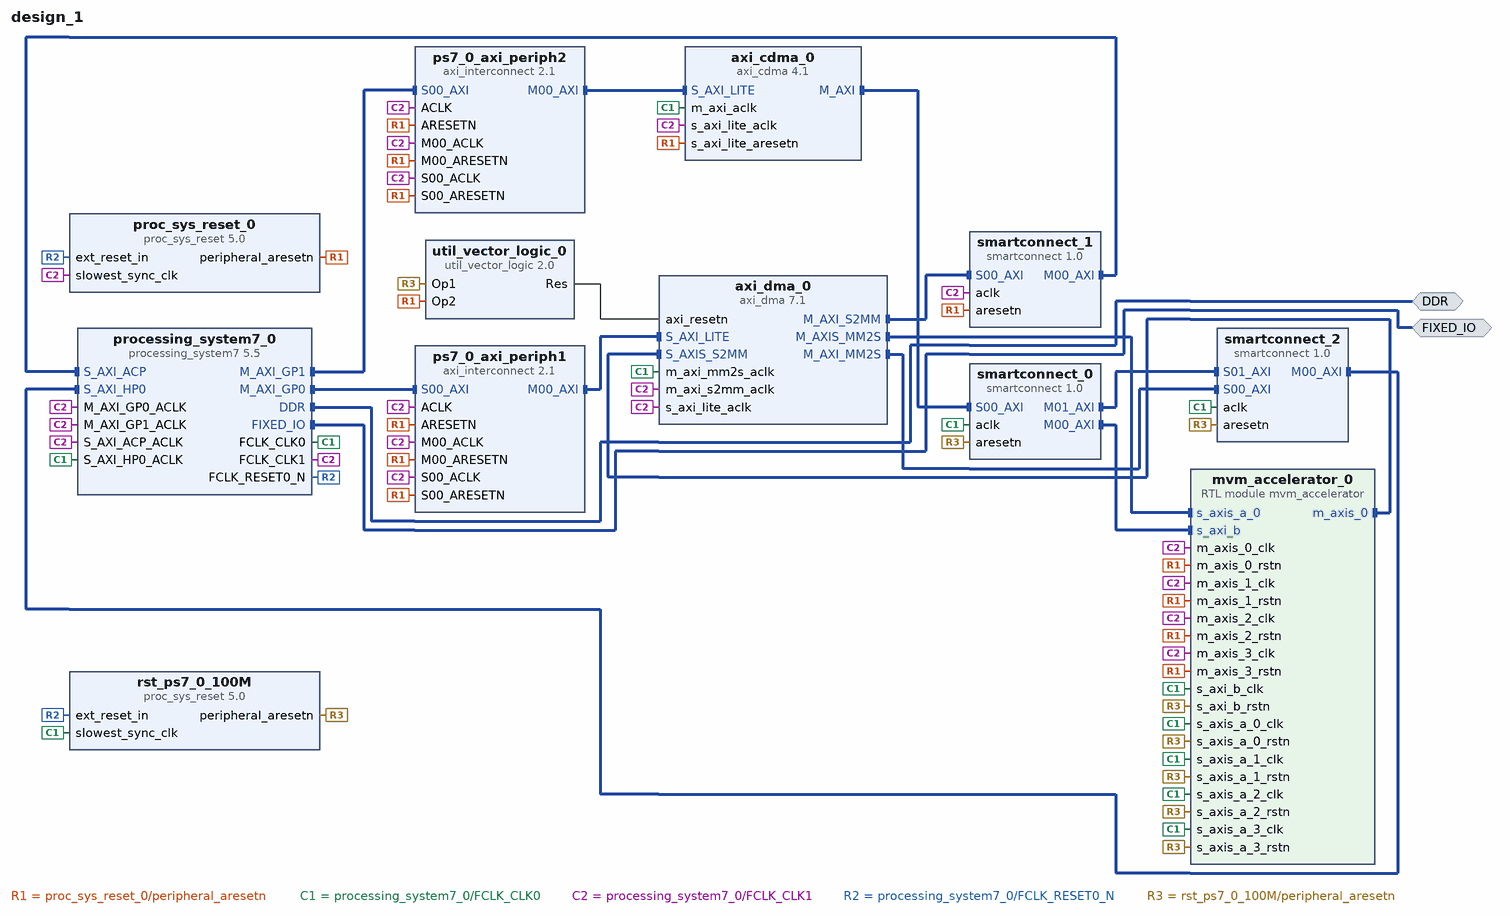
[diagram p0: block diagram of the top level]
# Vivado block design design_1, xc7z020clg400-1, Vivado 2023.2
create_bd_design design_1

create_bd_intf_port -mode Master -vlnv xilinx.com:interface:ddrx_rtl:1.0 DDR
create_bd_intf_port -mode Master -vlnv xilinx.com:display_processing_system7:fixedio_rtl:1.0 FIXED_IO

create_bd_cell -type ip -vlnv xilinx.com:ip:axi_dma:7.1 axi_dma_0
set_property -dict [list \
  CONFIG.c_include_mm2s_dre 1 \
  CONFIG.c_include_s2mm 1 \
  CONFIG.c_include_s2mm_dre 1 \
  CONFIG.c_include_sg 0 \
  CONFIG.c_m_axi_mm2s_data_width 64 \
  CONFIG.c_m_axi_s2mm_data_width 64 \
  CONFIG.c_m_axis_mm2s_tdata_width 64 \
  CONFIG.c_mm2s_burst_size 256 \
  CONFIG.c_s2mm_burst_size 8 \
  CONFIG.c_s_axis_s2mm_tdata_width 64 \
  CONFIG.c_sg_length_width 18 \
] [get_bd_cells axi_dma_0]
create_bd_cell -type ip -vlnv xilinx.com:ip:proc_sys_reset:5.0 rst_ps7_0_100M
create_bd_cell -type module -reference mvm_accelerator mvm_accelerator_0
set_property -dict [list \
  CONFIG.AXI_RAM_ID_WIDTH 8 \
  CONFIG.DATA_WIDTH 64 \
  CONFIG.ELEMENTS_PER_ROW 8192 \
  CONFIG.ELEMENTS_PER_WORD 1 \
  CONFIG.NUM_CHANNELS 1 \
  CONFIG.NUM_RAM_PARTITIONS 1 \
  CONFIG.NUM_ROWS 1024 \
  CONFIG.ROWS_PER_CHANNEL 1024 \
  CONFIG.STRB_WIDTH 8 \
  CONFIG.WORDS_PER_ROW 8192 \
] [get_bd_cells mvm_accelerator_0]
create_bd_cell -type ip -vlnv xilinx.com:ip:axi_interconnect:2.1 ps7_0_axi_periph1
set_property -dict {CONFIG.ENABLE_ADVANCED_OPTIONS 0 CONFIG.NUM_MI 1 CONFIG.NUM_SI 1} [get_bd_cells ps7_0_axi_periph1]
create_bd_cell -type ip -vlnv xilinx.com:ip:processing_system7:5.5 processing_system7_0
set_property -dict [list \
  CONFIG.PCW_APU_PERIPHERAL_FREQMHZ 650 \
  CONFIG.PCW_CRYSTAL_PERIPHERAL_FREQMHZ 50 \
  CONFIG.PCW_ENET0_ENET0_IO {MIO 16 .. 27} \
  CONFIG.PCW_ENET0_GRP_MDIO_ENABLE 1 \
  CONFIG.PCW_ENET0_GRP_MDIO_IO {MIO 52 .. 53} \
  CONFIG.PCW_ENET0_PERIPHERAL_ENABLE 1 \
  CONFIG.PCW_ENET0_RESET_ENABLE 1 \
  CONFIG.PCW_ENET0_RESET_IO {MIO 9} \
  CONFIG.PCW_ENET_RESET_ENABLE 1 \
  CONFIG.PCW_ENET_RESET_SELECT {Share reset pin} \
  CONFIG.PCW_EN_CLK1_PORT 1 \
  CONFIG.PCW_FCLK_CLK1_BUF TRUE \
  CONFIG.PCW_FPGA0_PERIPHERAL_FREQMHZ 200 \
  CONFIG.PCW_FPGA1_PERIPHERAL_FREQMHZ 100 \
  CONFIG.PCW_FPGA_FCLK1_ENABLE 1 \
  CONFIG.PCW_GPIO_MIO_GPIO_ENABLE 1 \
  CONFIG.PCW_GPIO_MIO_GPIO_IO MIO \
  CONFIG.PCW_I2C_RESET_ENABLE 1 \
  CONFIG.PCW_M_AXI_GP0_FREQMHZ 10 \
  CONFIG.PCW_PERIPHERAL_BOARD_PRESET part0 \
  CONFIG.PCW_PRESET_BANK1_VOLTAGE {LVCMOS 1.8V} \
  CONFIG.PCW_QSPI_PERIPHERAL_ENABLE 0 \
  CONFIG.PCW_SD0_GRP_CD_ENABLE 1 \
  CONFIG.PCW_SD0_GRP_CD_IO {MIO 47} \
  CONFIG.PCW_SD0_GRP_WP_ENABLE 0 \
  CONFIG.PCW_SD0_PERIPHERAL_ENABLE 1 \
  CONFIG.PCW_SD0_SD0_IO {MIO 40 .. 45} \
  CONFIG.PCW_SDIO_PERIPHERAL_FREQMHZ 50 \
  CONFIG.PCW_S_AXI_HP0_FREQMHZ 10 \
  CONFIG.PCW_UART0_PERIPHERAL_ENABLE 1 \
  CONFIG.PCW_UART0_UART0_IO {MIO 14 .. 15} \
  CONFIG.PCW_UART1_PERIPHERAL_ENABLE 0 \
  CONFIG.PCW_UART_PERIPHERAL_FREQMHZ 100 \
  CONFIG.PCW_UIPARAM_DDR_BUS_WIDTH {16 Bit} \
  CONFIG.PCW_UIPARAM_DDR_FREQ_MHZ 525 \
  CONFIG.PCW_UIPARAM_DDR_PARTNO {MT41J256M16 RE-125} \
  CONFIG.PCW_USB0_PERIPHERAL_ENABLE 0 \
  CONFIG.PCW_USB_RESET_ENABLE 1 \
  CONFIG.PCW_USE_DEFAULT_ACP_USER_VAL 1 \
  CONFIG.PCW_USE_M_AXI_GP1 1 \
  CONFIG.PCW_USE_S_AXI_ACP 1 \
  CONFIG.PCW_USE_S_AXI_HP0 1 \
] [get_bd_cells processing_system7_0]
# 502 more settings of processing_system7_0 are not shown: defaults, MIO pin electricals, DDR timing, and values the tool derives
create_bd_cell -type ip -vlnv xilinx.com:ip:proc_sys_reset:5.0 proc_sys_reset_0
create_bd_cell -type ip -vlnv xilinx.com:ip:util_vector_logic:2.0 util_vector_logic_0
set_property -dict {CONFIG.C_SIZE 1} [get_bd_cells util_vector_logic_0]
create_bd_cell -type ip -vlnv xilinx.com:ip:axi_cdma:4.1 axi_cdma_0
set_property -dict [list \
  CONFIG.C_INCLUDE_DRE 1 \
  CONFIG.C_INCLUDE_SF 0 \
  CONFIG.C_INCLUDE_SG 0 \
  CONFIG.C_M_AXI_DATA_WIDTH 64 \
  CONFIG.C_M_AXI_MAX_BURST_LEN 256 \
  CONFIG.C_USE_DATAMOVER_LITE 0 \
] [get_bd_cells axi_cdma_0]
create_bd_cell -type ip -vlnv xilinx.com:ip:axi_interconnect:2.1 ps7_0_axi_periph2
set_property -dict {CONFIG.ENABLE_ADVANCED_OPTIONS 0 CONFIG.NUM_MI 1 CONFIG.NUM_SI 1} [get_bd_cells ps7_0_axi_periph2]
create_bd_cell -type ip -vlnv xilinx.com:ip:smartconnect:1.0 smartconnect_0
set_property -dict {CONFIG.NUM_MI 2 CONFIG.NUM_SI 1} [get_bd_cells smartconnect_0]
create_bd_cell -type ip -vlnv xilinx.com:ip:smartconnect:1.0 smartconnect_1
set_property -dict {CONFIG.NUM_SI 1} [get_bd_cells smartconnect_1]
create_bd_cell -type ip -vlnv xilinx.com:ip:smartconnect:1.0 smartconnect_2
set_property -dict {CONFIG.NUM_SI 2} [get_bd_cells smartconnect_2]

# ---- connections ----

connect_bd_intf_net [get_bd_intf_pins axi_cdma_0/M_AXI] [get_bd_intf_pins smartconnect_0/S00_AXI]
connect_bd_intf_net [get_bd_intf_pins axi_dma_0/M_AXIS_MM2S] [get_bd_intf_pins mvm_accelerator_0/s_axis_a_0]
connect_bd_intf_net [get_bd_intf_pins smartconnect_2/S00_AXI] [get_bd_intf_pins axi_dma_0/M_AXI_MM2S]
connect_bd_intf_net [get_bd_intf_pins axi_dma_0/M_AXI_S2MM] [get_bd_intf_pins smartconnect_1/S00_AXI]
connect_bd_intf_net [get_bd_intf_pins mvm_accelerator_0/m_axis_0] [get_bd_intf_pins axi_dma_0/S_AXIS_S2MM]
connect_bd_intf_net [get_bd_intf_ports DDR] [get_bd_intf_pins processing_system7_0/DDR]
connect_bd_intf_net [get_bd_intf_ports FIXED_IO] [get_bd_intf_pins processing_system7_0/FIXED_IO]
connect_bd_intf_net [get_bd_intf_pins ps7_0_axi_periph1/S00_AXI] [get_bd_intf_pins processing_system7_0/M_AXI_GP0]
connect_bd_intf_net [get_bd_intf_pins processing_system7_0/M_AXI_GP1] [get_bd_intf_pins ps7_0_axi_periph2/S00_AXI]
connect_bd_intf_net [get_bd_intf_pins ps7_0_axi_periph1/M00_AXI] [get_bd_intf_pins axi_dma_0/S_AXI_LITE]
connect_bd_intf_net [get_bd_intf_pins ps7_0_axi_periph2/M00_AXI] [get_bd_intf_pins axi_cdma_0/S_AXI_LITE]
connect_bd_intf_net [get_bd_intf_pins smartconnect_0/M00_AXI] [get_bd_intf_pins mvm_accelerator_0/s_axi_b]
connect_bd_intf_net [get_bd_intf_pins smartconnect_0/M01_AXI] [get_bd_intf_pins smartconnect_2/S01_AXI]
connect_bd_intf_net [get_bd_intf_pins smartconnect_1/M00_AXI] [get_bd_intf_pins processing_system7_0/S_AXI_ACP]
connect_bd_intf_net [get_bd_intf_pins smartconnect_2/M00_AXI] [get_bd_intf_pins processing_system7_0/S_AXI_HP0]
connect_bd_net -net ARESETN_1 [get_bd_pins proc_sys_reset_0/peripheral_aresetn] \
  [get_bd_pins ps7_0_axi_periph1/ARESETN] [get_bd_pins ps7_0_axi_periph1/S00_ARESETN] \
  [get_bd_pins ps7_0_axi_periph1/M00_ARESETN] [get_bd_pins util_vector_logic_0/Op2] [get_bd_pins ps7_0_axi_periph2/ARESETN] \
  [get_bd_pins ps7_0_axi_periph2/S00_ARESETN] [get_bd_pins ps7_0_axi_periph2/M00_ARESETN] \
  [get_bd_pins axi_cdma_0/s_axi_lite_aresetn] [get_bd_pins smartconnect_1/aresetn] \
  [get_bd_pins mvm_accelerator_0/m_axis_0_rstn] [get_bd_pins mvm_accelerator_0/m_axis_1_rstn] \
  [get_bd_pins mvm_accelerator_0/m_axis_2_rstn] [get_bd_pins mvm_accelerator_0/m_axis_3_rstn]
connect_bd_net [get_bd_pins processing_system7_0/FCLK_CLK0] \
  [get_bd_pins axi_dma_0/m_axi_mm2s_aclk] [get_bd_pins processing_system7_0/S_AXI_HP0_ACLK] \
  [get_bd_pins rst_ps7_0_100M/slowest_sync_clk] [get_bd_pins axi_cdma_0/m_axi_aclk] [get_bd_pins smartconnect_0/aclk] \
  [get_bd_pins smartconnect_2/aclk] [get_bd_pins mvm_accelerator_0/s_axis_a_0_clk] \
  [get_bd_pins mvm_accelerator_0/s_axi_b_clk] [get_bd_pins mvm_accelerator_0/s_axis_a_1_clk] \
  [get_bd_pins mvm_accelerator_0/s_axis_a_2_clk] [get_bd_pins mvm_accelerator_0/s_axis_a_3_clk]
connect_bd_net [get_bd_pins processing_system7_0/FCLK_CLK1] \
  [get_bd_pins processing_system7_0/S_AXI_ACP_ACLK] [get_bd_pins axi_dma_0/m_axi_s2mm_aclk] \
  [get_bd_pins ps7_0_axi_periph1/S00_ACLK] [get_bd_pins ps7_0_axi_periph1/M00_ACLK] [get_bd_pins axi_dma_0/s_axi_lite_aclk] \
  [get_bd_pins proc_sys_reset_0/slowest_sync_clk] [get_bd_pins ps7_0_axi_periph1/ACLK] \
  [get_bd_pins processing_system7_0/M_AXI_GP0_ACLK] [get_bd_pins processing_system7_0/M_AXI_GP1_ACLK] \
  [get_bd_pins axi_cdma_0/s_axi_lite_aclk] [get_bd_pins ps7_0_axi_periph2/ACLK] [get_bd_pins ps7_0_axi_periph2/S00_ACLK] \
  [get_bd_pins ps7_0_axi_periph2/M00_ACLK] [get_bd_pins smartconnect_1/aclk] [get_bd_pins mvm_accelerator_0/m_axis_0_clk] \
  [get_bd_pins mvm_accelerator_0/m_axis_1_clk] [get_bd_pins mvm_accelerator_0/m_axis_2_clk] \
  [get_bd_pins mvm_accelerator_0/m_axis_3_clk]
connect_bd_net [get_bd_pins processing_system7_0/FCLK_RESET0_N] [get_bd_pins rst_ps7_0_100M/ext_reset_in] [get_bd_pins proc_sys_reset_0/ext_reset_in]
connect_bd_net [get_bd_pins rst_ps7_0_100M/peripheral_aresetn] \
  [get_bd_pins util_vector_logic_0/Op1] [get_bd_pins smartconnect_0/aresetn] [get_bd_pins smartconnect_2/aresetn] \
  [get_bd_pins mvm_accelerator_0/s_axis_a_0_rstn] [get_bd_pins mvm_accelerator_0/s_axi_b_rstn] \
  [get_bd_pins mvm_accelerator_0/s_axis_a_1_rstn] [get_bd_pins mvm_accelerator_0/s_axis_a_2_rstn] \
  [get_bd_pins mvm_accelerator_0/s_axis_a_3_rstn]
connect_bd_net [get_bd_pins util_vector_logic_0/Res] [get_bd_pins axi_dma_0/axi_resetn]

# ---- address map ----
assign_bd_address -offset 0x00000000 -range 512M -target_address_space [get_bd_addr_spaces axi_cdma_0/Data] [get_bd_addr_segs processing_system7_0/S_AXI_HP0/HP0_DDR_LOWOCM]
assign_bd_address -offset 0x80000000 -range 256K -target_address_space [get_bd_addr_spaces axi_cdma_0/Data] [get_bd_addr_segs mvm_accelerator_0/s_axi_b/reg0]
assign_bd_address -offset 0x00000000 -range 512M -target_address_space [get_bd_addr_spaces axi_dma_0/Data_MM2S] [get_bd_addr_segs processing_system7_0/S_AXI_HP0/HP0_DDR_LOWOCM]
assign_bd_address -offset 0x00000000 -range 512M -target_address_space [get_bd_addr_spaces axi_dma_0/Data_S2MM] [get_bd_addr_segs processing_system7_0/S_AXI_ACP/ACP_DDR_LOWOCM]
exclude_bd_addr_seg -offset 0x40000000 -range 1G -target_address_space [get_bd_addr_spaces axi_dma_0/Data_S2MM] [get_bd_addr_segs processing_system7_0/S_AXI_ACP/ACP_M_AXI_GP0]
exclude_bd_addr_seg -offset 0x80000000 -range 1G -target_address_space [get_bd_addr_spaces axi_dma_0/Data_S2MM] [get_bd_addr_segs processing_system7_0/S_AXI_ACP/ACP_M_AXI_GP1]
exclude_bd_addr_seg -offset 0xE0000000 -range 4M -target_address_space [get_bd_addr_spaces axi_dma_0/Data_S2MM] [get_bd_addr_segs processing_system7_0/S_AXI_ACP/ACP_IOP]
assign_bd_address -offset 0x40000000 -range 256K -target_address_space [get_bd_addr_spaces processing_system7_0/Data] [get_bd_addr_segs axi_dma_0/S_AXI_LITE/Reg]
assign_bd_address -offset 0xA0000000 -range 256K -target_address_space [get_bd_addr_spaces processing_system7_0/Data] [get_bd_addr_segs axi_cdma_0/S_AXI_LITE/Reg]

validate_bd_design
save_bd_design
